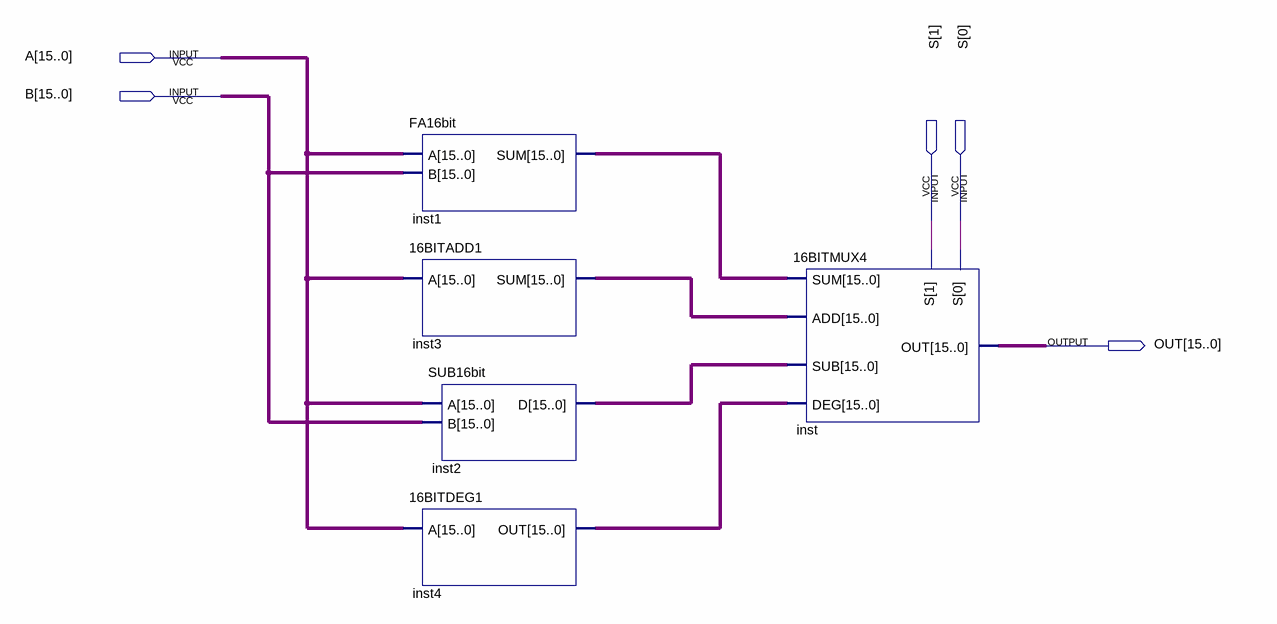
[diagram p0: schematic sheet]
// Quartus schematic AU.bdf as structural Verilog: 5 symbols, 5 pins
module AU (
  input  [15:0] A,
  input  [15:0] B,
  input  [1:0] S,
  output [15:0] OUT
);

  wire [15:0] inst1_sum, inst2_d, inst3_sum, inst4_out;

  FA16bit inst1 (.A(A), .B(B), .SUM(inst1_sum));
  \16BITADD1  inst3 (.A(A), .SUM(inst3_sum));
  SUB16bit inst2 (.A(A), .B(B), .D(inst2_d));
  \16BITDEG1  inst4 (.A(A), .OUT(inst4_out));
  \16BITMUX4  inst (.SUM(inst1_sum), .SUB(inst2_d), .ADD(inst3_sum), .DEG(inst4_out), .S(S), .OUT(OUT));
endmodule
